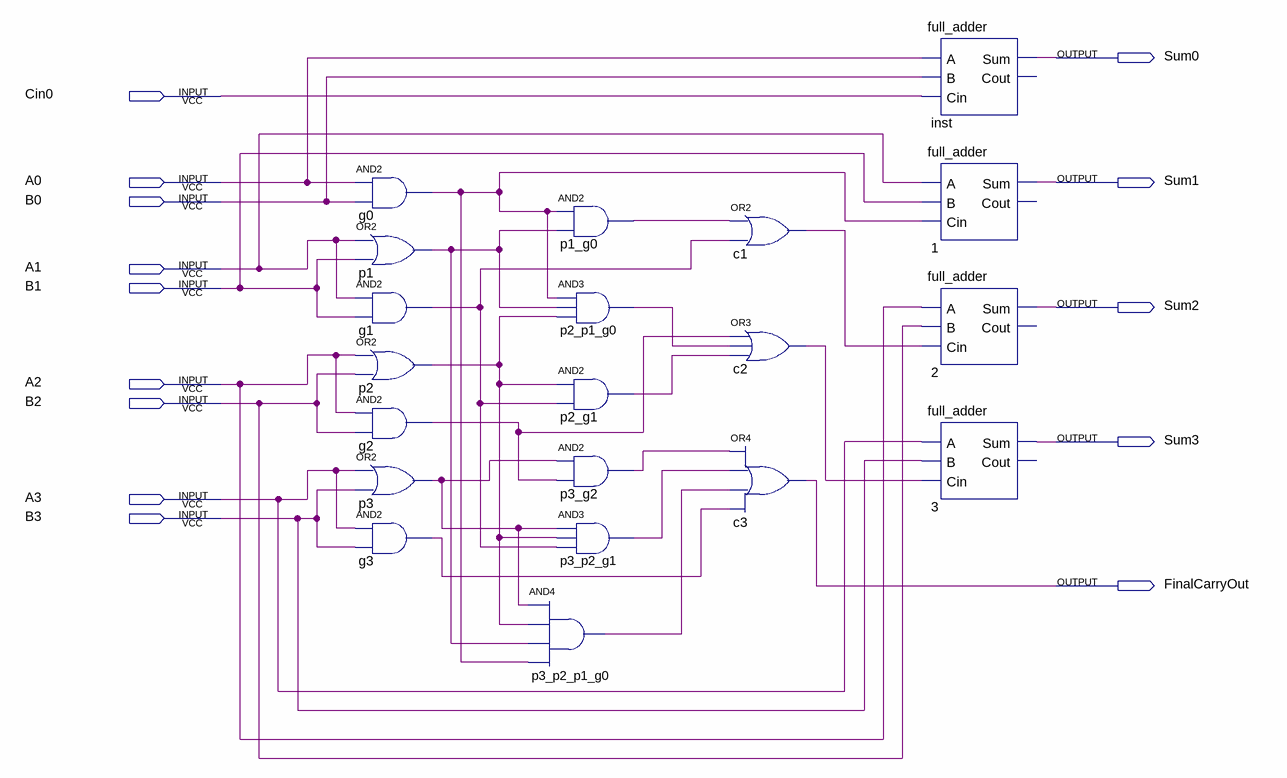
[diagram p0: schematic sheet]
// Quartus schematic CLA.bdf as structural Verilog: 20 symbols, 14 pins
module CLA (
  input  Cin0,
  input  A0,
  input  B0,
  input  A1,
  input  B1,
  input  A2,
  input  B2,
  input  A3,
  input  B3,
  output Sum0,
  output Sum1,
  output Sum2,
  output Sum3,
  output FinalCarryOut
);

  wire c1_out, c2_out, g0_out, g1_out, g2_out, g3_out, p1_g0_out, p1_out, p2_g1_out, p2_out, p2_p1_g0_out,
       p3_g2_out, p3_out, p3_p2_g1_out, p3_p2_p1_g0_out;

  and g0 (g0_out, A0, B0);
  or p1 (p1_out, A1, B1);
  and g1 (g1_out, A1, B1);
  or p2 (p2_out, A2, B2);
  and g2 (g2_out, A2, B2);
  or p3 (p3_out, A3, B3);
  and g3 (g3_out, A3, B3);
  and p3_p2_p1_g0 (p3_p2_p1_g0_out, p3_out, p2_out, p1_out, g0_out);
  and p1_g0 (p1_g0_out, g0_out, p1_out);
  and p2_p1_g0 (p2_p1_g0_out, g0_out, p1_out, p2_out);
  and p2_g1 (p2_g1_out, p2_out, g1_out);
  and p3_g2 (p3_g2_out, p3_out, g2_out);
  and p3_p2_g1 (p3_p2_g1_out, p3_out, p2_out, g1_out);
  or c1 (c1_out, p1_g0_out, g1_out);
  or c2 (c2_out, g2_out, p2_p1_g0_out, p2_g1_out);
  or c3 (FinalCarryOut, p3_g2_out, p3_p2_g1_out, p3_p2_p1_g0_out, g3_out);
  full_adder inst (.A(A0), .B(B0), .Cin(Cin0), .Sum(Sum0));  // open: Cout
  full_adder u_1 (.A(A1), .B(B1), .Cin(g0_out), .Sum(Sum1));  // open: Cout
  full_adder u_2 (.A(A2), .B(B2), .Cin(c1_out), .Sum(Sum2));  // open: Cout
  full_adder u_3 (.A(A3), .B(B3), .Cin(c2_out), .Sum(Sum3));  // open: Cout
endmodule
